# EAGLE design Sensore di allagamento (EAGLE 7.6.0)
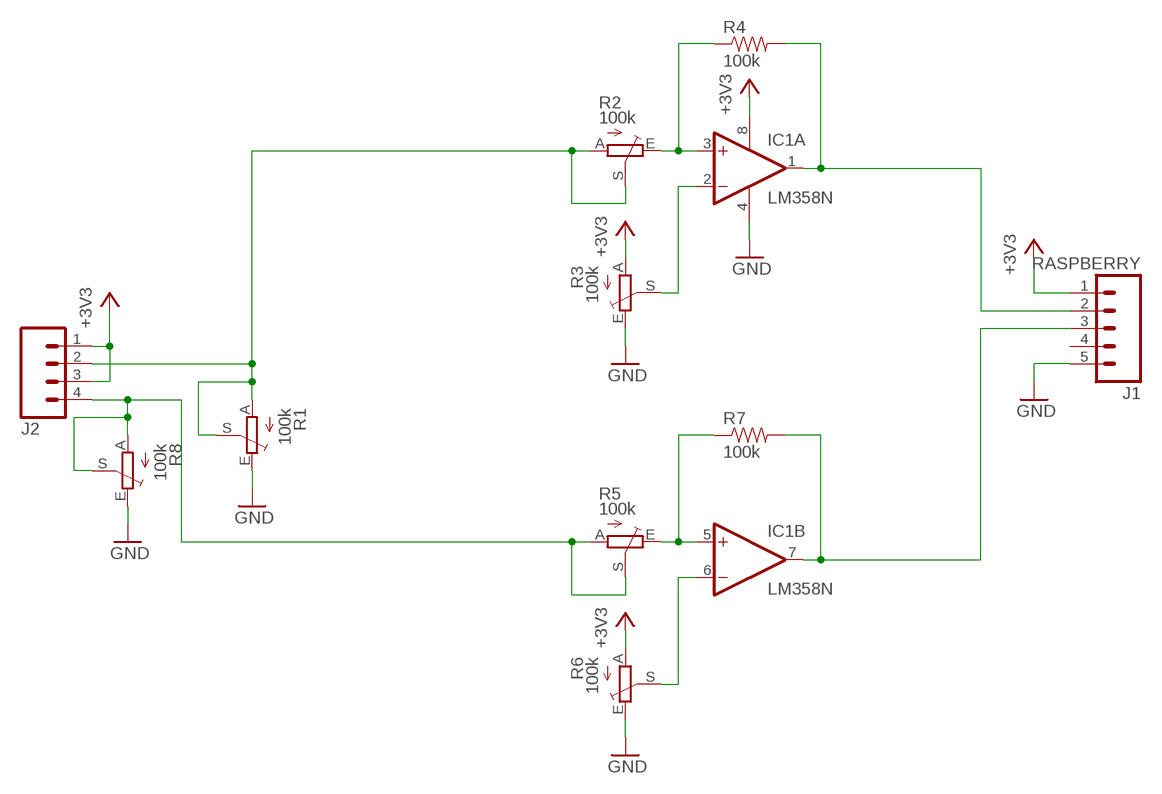
[diagram p0: schematic, sheet 1]

## Parts
IC1  LM358N  [DIL08]
J1  RASPBERRY  M05PTH  [1X05]
J2  M04POLAR  [MOLEX-1X4]
R1  100k  TRIM_EU-CA9V  [CA9V]
R2  100k  TRIM_EU-CA9V  [CA9V]
R3  100k  TRIM_EU-CA9V  [CA9V]
R4  100k  100KOHM-1/4W-1%(PTH)HORIZ  [AXIAL-0.3]
R5  100k  TRIM_EU-CA9V  [CA9V]
R6  100k  TRIM_EU-CA9V  [CA9V]
R7  100k  100KOHM-1/4W-1%(PTH)HORIZ  [AXIAL-0.3]
R8  100k  TRIM_EU-CA9V  [CA9V]

## Nets
+3V3: IC1.8(P:V+) J1.1 J2.1 J2.3 R3.A R6.A
GND: IC1.4(P:V-) J1.5 R1.E R3.E R6.E R8.E
N$1: J2.2 R1.A R1.S R2.A R2.S
N$2: IC1.5(B:+IN) R5.E R7.P$1
N$3: IC1.6(B:-IN) R6.S
N$4: IC1.3(A:+IN) R2.E R4.P$1
N$5: IC1.2(A:-IN) R3.S
N$6: IC1.7(B:OUT) J1.3 R7.P$2
N$7: IC1.1(A:OUT) J1.2 R4.P$2
N$8: J2.4 R5.A R5.S R8.A R8.S
Unconnected: J1.4

## Library data of the parts
IC1 = linear:LM358: OP AMP also LM158; LM258; LM2904 Source: http://cache.national.com/ds/LM/LM158.pdf
J1 = SparkFun-Connectors:M05: Header 5 Standard 5-pin 0.1" header. Use with straight break away headers (SKU : PRT-00116), right angle break away headers (PRT-00553), swiss pins (PRT-00743), machine pins (PRT-00117), and female headers (PRT-00115). Molex polarized connector foot print use with SKU : PRT-08230 with associated crimp pins and housings.
J2 = SparkFun-Connectors:M04: Header 4 Standard 4-pin 0.1" header. Use with straight break away headers (SKU : PRT-00116), right angle break away headers (PRT-00553), swiss pins (PRT-00743), machine pins (PRT-00117), and female headers (PRT-00115). Molex polarized connector foot print use with SKU : PRT-08231 with associated crimp pins and housings. 1MM SMD Version SKU: PRT-10208
R1-R3 R5 R6 R8 = pot:TRIM_EU-: POTENTIOMETER
R4 R7 = SparkFun-Resistors:100KOHM-1/4W-1%(PTH): RES-12184; PROD_ID: RES-12184; VALUE: 100K

## Board
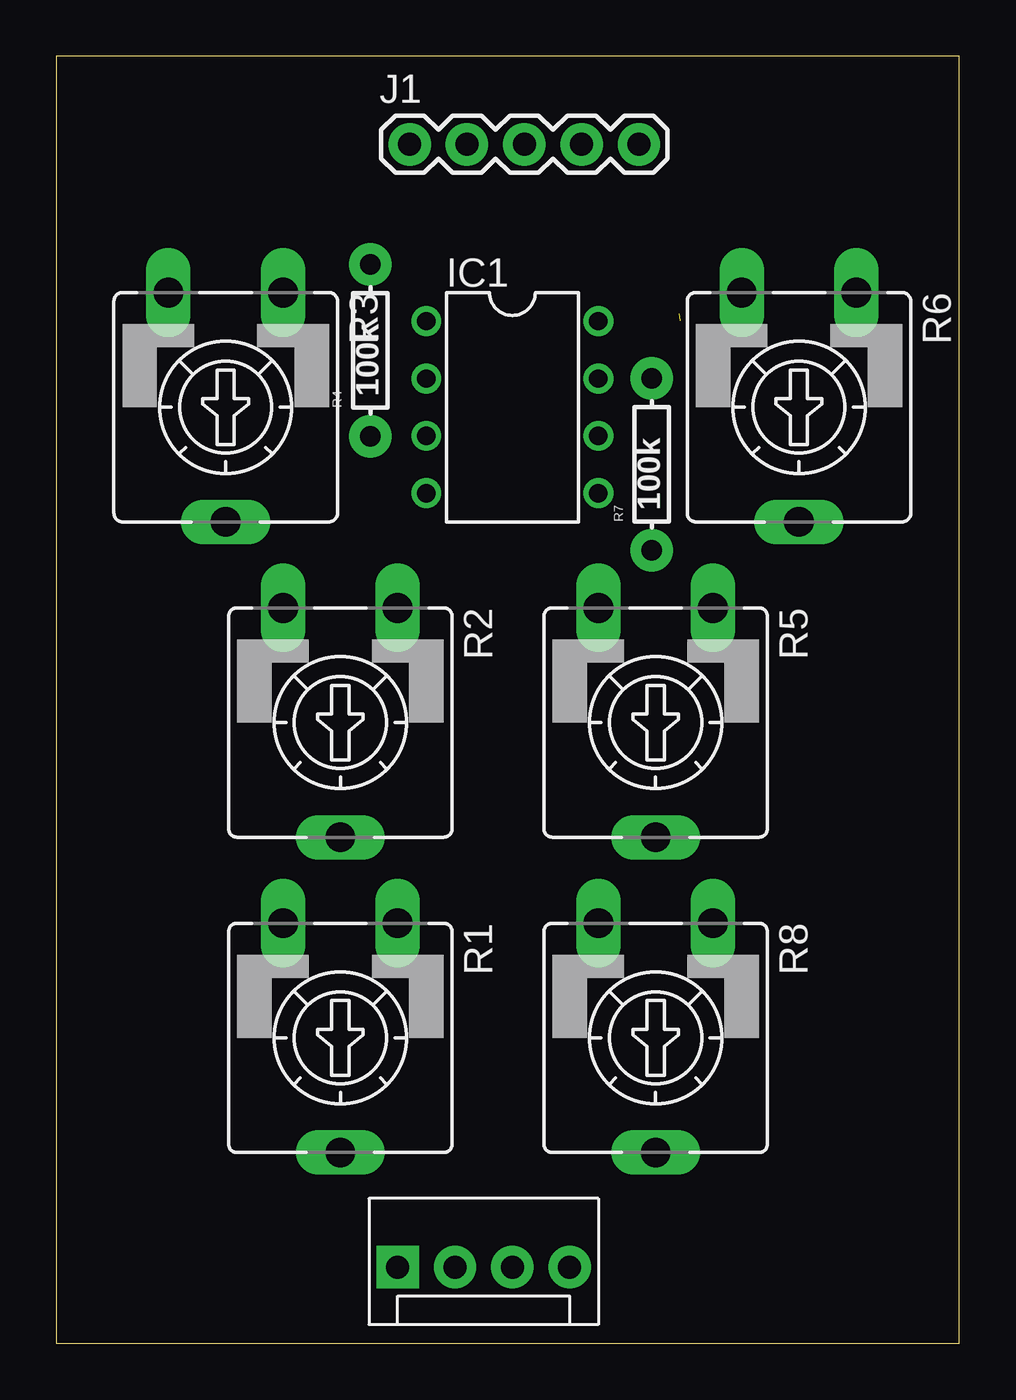
[diagram p1: board, top side]
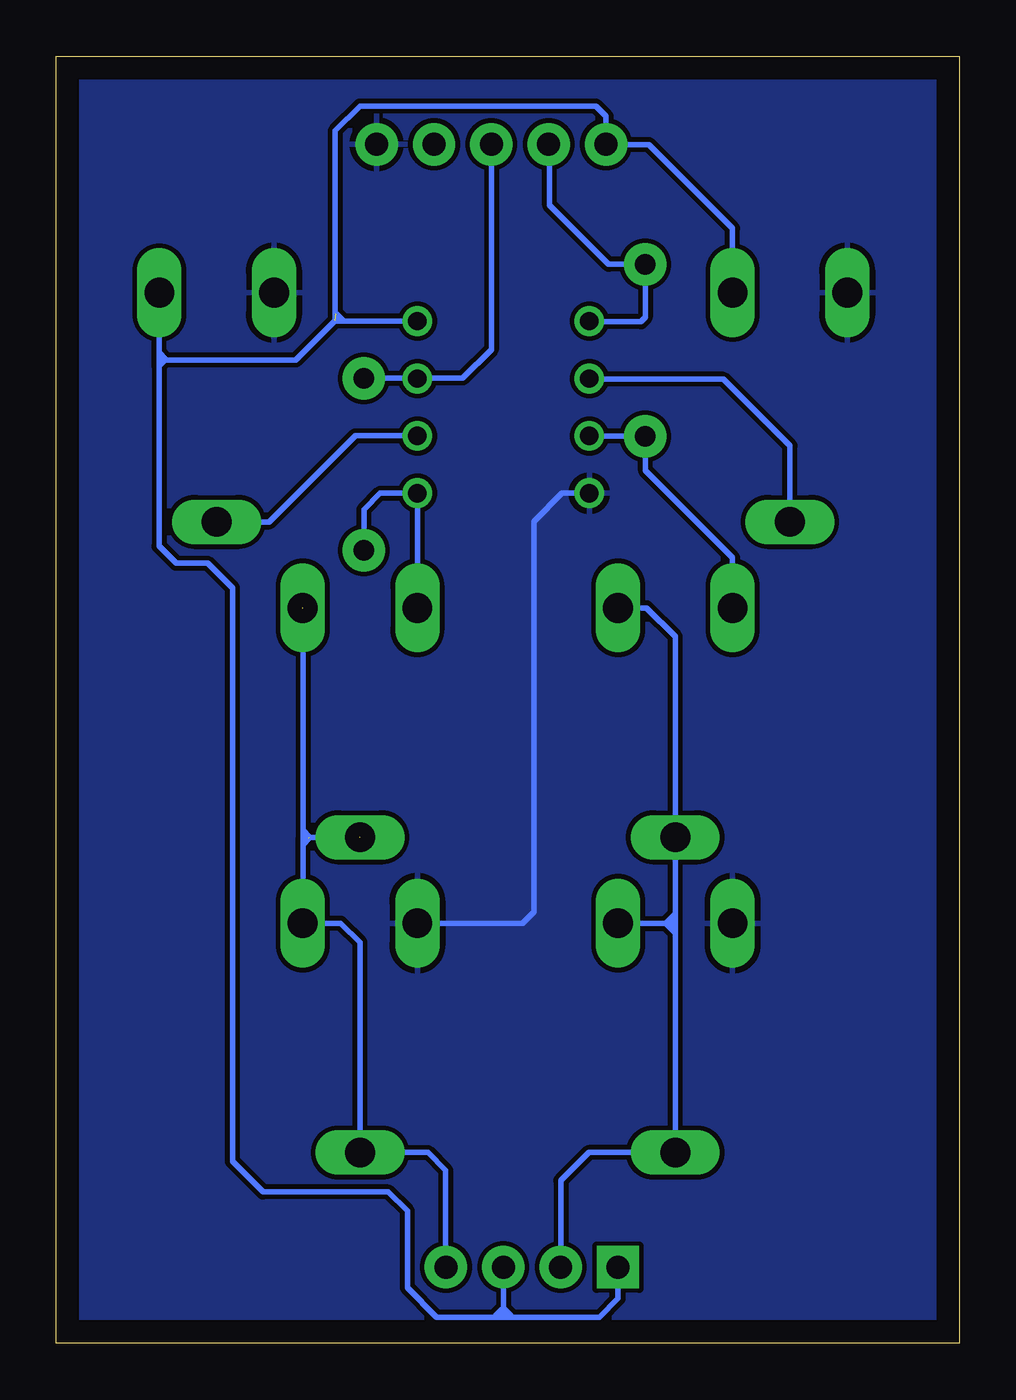
[diagram p2: board, bottom side, seen from below]

Size 40 x 57 mm. Coordinates in mm from the lower left corner, seen from the top.
Outline: 0,0 40,0 40,57 0,57 0,0
Copper layers (1*16): Top 0.035mm / dielectric 1.5mm / Bottom 0.035mm
Design rules "default": minimum track width 10mil, minimum drill 24mil, track to track 8mil, track to pad 8mil, pad to pad 8mil, via to via 8mil, smd to smd 8mil, copper to edge 40mil, drill to drill 8mil, minimum pad ring 10mil, minimum via ring 8mil, stop-mask expansion 4mil, vias tented up to drill 0mil, thermal gap 10mil

### Footprints (pad centres in the part's own frame; a part is rotated, then mirrored left to right if it is on the bottom)
DIL08 = drill 0.813 pad 1.27: 1 -3.81,-3.81; 2 -1.27,-3.81; 3 1.27,-3.81; 4 3.81,-3.81; 5 3.81,3.81; 6 1.27,3.81; 7 -1.27,3.81; 8 -3.81,3.81
1X05 = drill 1.016 pad 1.88: 1 0,0; 2 2.54,0; 3 5.08,0; 4 7.62,0; 5 10.16,0
MOLEX-1X4 = drill 1.016 pad 1.88 square: 1 0,0 | drill 1.016 pad 1.88: 2 2.54,0; 3 5.08,0; 4 7.62,0
CA9V = drill 1.321 long: A -2.54,-5.08; E 2.54,-5.08; S 0,5.08
AXIAL-0.3 = drill 0.9 pad 1.88: P$1 -3.81,0; P$2 3.81,0

### Placement (x,y rotation side)
IC1  20.2,41.46 270 top
J1  15.65,53.11 0 top
J2  15.12,3.36 0 top
R1  12.58,13.52 180 top
R2  12.58,27.49 180 top
R3  7.5,41.46 180 top
R4  13.91,43.98 90 top
R5  26.55,27.49 180 top
R6  32.9,41.46 180 top
R7  26.38,38.93 90 top
R8  26.55,13.52 180 top

### Tracks (layer width: path | path; a pad name or v marks a point on that pad's centre or on a via)
+3V3  (1 unrouted)
  Bottom 0.254: J2.1 15.12,1.98 15.95,1.15 19.85,1.15 | 19.85,1.15 20.2,1.15 | R3.A 10.04,49.39 13.75,53.1 J1.1 15.65,54.35 16.1,54.8 26.55,54.8 27.65,53.7 27.65,45.3 27.68,45.27 | IC1.8 27.68,45.27 | 27.68,45.27 29.4,43.55 35.45,43.55 | 35.45,43.55 35.45,43.9 | 35.45,43.9 R6.A | J2.3 20.2,1.15 | 20.2,1.15 23.15,1.15 24.45,2.45 24.45,5.85 25.3,6.7 30.85,6.7 32.2,8.05 32.2,33.45 33.3,34.55 34.7,34.55 35.45,35.3 35.45,43.3 | 35.45,43.55 35.45,43.3 | 35.45,43.9 35.15,43.6 35.45,43.3 | 20.55,1.2 20.25,1.5 20.15,1.5 19.85,1.2 19.85,1.15 | 27.6,45.6 27.3,45.3
GND
  Bottom 0.254: R8.E 19.35,18.6 18.85,19.1 18.85,36.4 17.6,37.65 IC1.4
  pour Bottom: 0,57 40,57 40,56.55 40,0 0,0
N$1
  Bottom 0.254: 12.58,18.6 R1.S 16.41,8.44 17.65,7.2 J2.2 | 12.58,18.6 R2.S 12.58,31.3 13.85,32.57 R2.A | R1.A 13,18.6 | 13,18.6 12.58,18.6 | 12.6,19 13,18.6 | 12.6,18.2 13,18.6
N$2
  Bottom 0.254: R5.E IC1.5 | 24.03,37.67 IC1.5 | R7.P$1 26.38,36.92 25.65,37.65 IC1.5
N$3
  Bottom 0.254: R6.S 30.57,36.38 26.75,40.2 IC1.6
N$4
  Bottom 0.254: IC1.3 16.37,40.17 R4.P$1 13.9,38.65 10.04,34.79 R2.E
N$5
  Bottom 0.254: R3.S 7.5,39.75 10.45,42.7 16.36,42.7 IC1.2
N$6
  Bottom 0.254: R7.P$2 IC1.7 23.99,42.75 22,42.75 20.73,44.02 J1.3
N$7
  Bottom 0.254: IC1.1 16.37,45.25 14.1,45.25 13.91,45.44 R4.P$2 15.54,47.79 18.15,50.4 18.15,53.07 J1.2
N$8  (3 unrouted)
  Bottom 0.254: J2.4 22.75,7.65 23.54,8.44 R8.S 26.55,17.75 27.4,18.6 R8.A 29.07,18.6 29.07,22.4 | 29.07,32.55 29.07,22.4 | R5.S 28.8,22.4 | 28.8,22.4 29.07,22.4 | 29.05,22.7 28.8,22.45 28.8,22.4 | 29.05,22.1 28.8,22.35